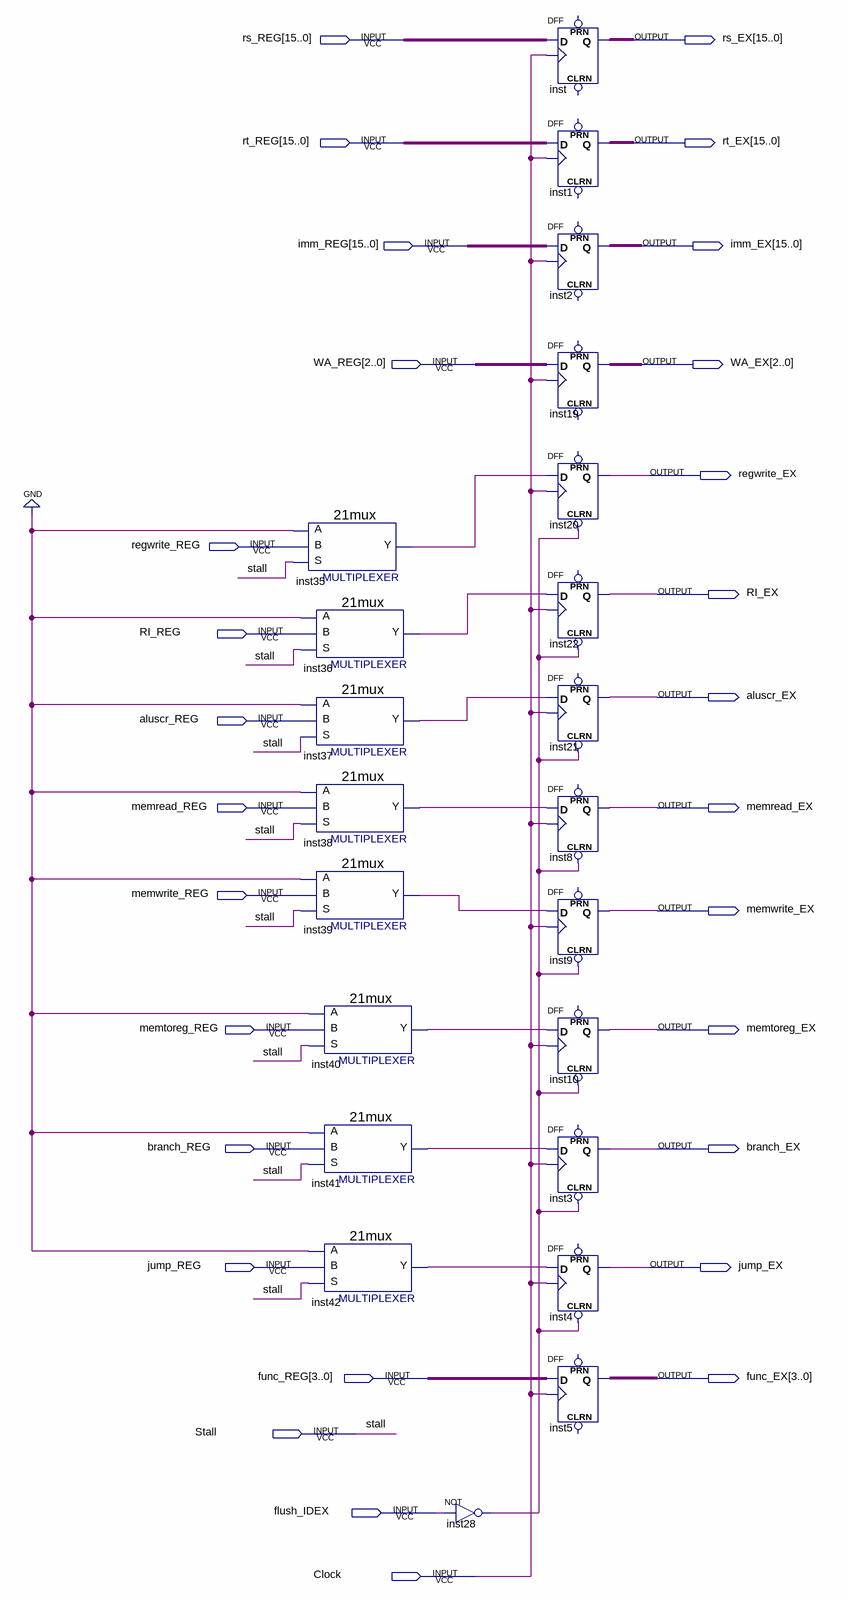
[diagram p0: schematic sheet]
// Quartus schematic REGEX.bdf as structural Verilog: 22 symbols, 29 pins
module REGEX (
  input  [15:0] rs_REG,
  input  [15:0] rt_REG,
  input  [15:0] imm_REG,
  input  [2:0] WA_REG,
  input  regwrite_REG,
  input  RI_REG,
  input  aluscr_REG,
  input  memread_REG,
  input  memwrite_REG,
  input  memtoreg_REG,
  input  branch_REG,
  input  jump_REG,
  input  [3:0] func_REG,
  input  Stall,
  input  flush_IDEX,
  input  Clock,
  output [15:0] rs_EX,
  output [15:0] rt_EX,
  output [15:0] imm_EX,
  output [2:0] WA_EX,
  output regwrite_EX,
  output RI_EX,
  output aluscr_EX,
  output memread_EX,
  output memwrite_EX,
  output memtoreg_EX,
  output branch_EX,
  output jump_EX,
  output [3:0] func_EX
);

  wire inst28_out, inst35_y, inst36_y, inst37_y, inst38_y, inst39_y, inst40_y, inst41_y, inst42_y;

  \21mux  inst35 (.S(Stall), .B(regwrite_REG), .A(1'b0), .Y(inst35_y));
  \21mux  inst36 (.S(Stall), .B(RI_REG), .A(1'b0), .Y(inst36_y));
  \21mux  inst37 (.S(Stall), .B(aluscr_REG), .A(1'b0), .Y(inst37_y));
  \21mux  inst38 (.S(Stall), .B(memread_REG), .A(1'b0), .Y(inst38_y));
  \21mux  inst39 (.S(Stall), .B(memwrite_REG), .A(1'b0), .Y(inst39_y));
  \21mux  inst40 (.S(Stall), .B(memtoreg_REG), .A(1'b0), .Y(inst40_y));
  \21mux  inst41 (.S(Stall), .B(branch_REG), .A(1'b0), .Y(inst41_y));
  \21mux  inst42 (.S(Stall), .B(jump_REG), .A(1'b0), .Y(inst42_y));
  not inst28 (inst28_out, flush_IDEX);
  DFF inst[15:0] (.CLK(Clock), .D(rs_REG), .Q(rs_EX));  // open: CLRN, PRN
  DFF inst1[15:0] (.CLK(Clock), .D(rt_REG), .Q(rt_EX));  // open: CLRN, PRN
  DFF inst2[15:0] (.CLK(Clock), .D(imm_REG), .Q(imm_EX));  // open: CLRN, PRN
  DFF inst19[2:0] (.CLK(Clock), .D(WA_REG), .Q(WA_EX));  // open: CLRN, PRN
  DFF inst20 (.CLRN(inst28_out), .CLK(Clock), .D(inst35_y), .Q(regwrite_EX));  // open: PRN
  DFF inst22 (.CLRN(inst28_out), .CLK(Clock), .D(inst36_y), .Q(RI_EX));  // open: PRN
  DFF inst21 (.CLRN(inst28_out), .CLK(Clock), .D(inst37_y), .Q(aluscr_EX));  // open: PRN
  DFF inst8 (.CLRN(inst28_out), .CLK(Clock), .D(inst38_y), .Q(memread_EX));  // open: PRN
  DFF inst9 (.CLRN(inst28_out), .CLK(Clock), .D(inst39_y), .Q(memwrite_EX));  // open: PRN
  DFF inst10 (.CLRN(inst28_out), .CLK(Clock), .D(inst40_y), .Q(memtoreg_EX));  // open: PRN
  DFF inst3 (.CLRN(inst28_out), .CLK(Clock), .D(inst41_y), .Q(branch_EX));  // open: PRN
  DFF inst4 (.CLRN(inst28_out), .CLK(Clock), .D(inst42_y), .Q(jump_EX));  // open: PRN
  DFF inst5[3:0] (.CLK(Clock), .D(func_REG), .Q(func_EX));  // open: CLRN, PRN
endmodule
